# Altium schematic sheet RS485.SchDoc
size A4; SheetNumber: 6; SheetTotal: 7
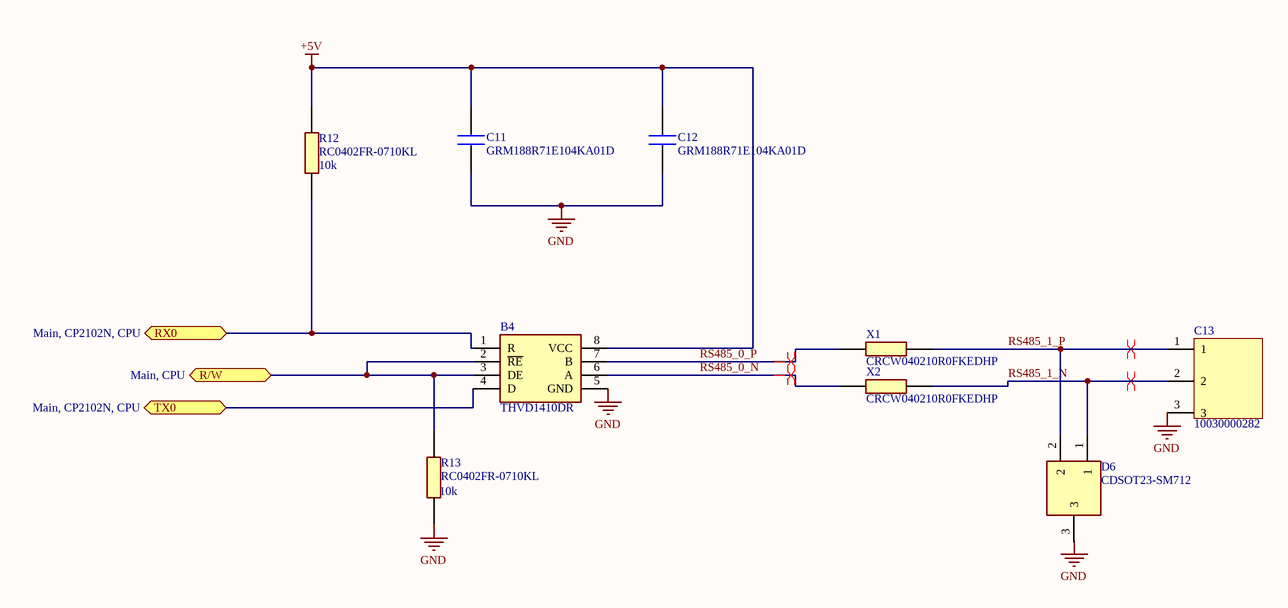
[diagram p0: RS485.SchDoc]

## Parts
B4  THVD1410DR  [SOIC127P600X175-8N]
C11  GRM188R71E104KA01D  [CAPC1608X90N]
C12  GRM188R71E104KA01D  [CAPC1608X90N]
C13  10030000282  [15EDGRC-5.08-03P-10030000282]
D6  CDSOT23-SM712  [SOT95P237X112-3N]
R12  RC0402FR-0710KL  value 10k  [RESC1005X40N]
R13  RC0402FR-0710KL  value 10k  [RESC1005X40N]
X1  CRCW040210R0FKEDHP  [RESC1005X40N]
X2  CRCW040210R0FKEDHP  [RESC1005X40N]

## Ports
R/W (bidir, see Main, CPU), RX0 (bidir, see Main, CP2102N, CPU), TX0 (bidir, see Main, CP2102N, CPU)

## Nets
+5V: B4.8(VCC) C11.2 C12.1 R12.2
GND: B4.5(GND) C11.1 C12.2 C13.3 R13.1
R/W: B4.2(~{RE}) B4.3(DE) R13.2 ; port R/W
RS485_0_N: B4.6(A) X2.1
RS485_0_P: B4.7(B) X1.1
RS485_1_N: C13.2 D6.1 X2.2
RS485_1_P: C13.1 D6.2 X1.2
RX0: B4.1(R) R12.1 ; port RX0
TX0: B4.4(D) ; port TX0

Not connected (* = marked no-connect by the designer): D6 3

## Layout directives
differential pair: RS485_0_N, RS485_0_P, RS485_1_N, RS485_1_P

## Notes on the sheet
- Labels drawn without touching a wire or pin: GND

## Library data of the parts
B4 = THVD1410DR: 3.3-V to 5-V RS-485 transceiver with +/-18-kV IEC ESD protection; Manufacturer_Name: Texas Instruments; Geometry.Height: 1.75mm; Mouser Part Number: 595-THVD1410DR; Mouser Price/Stock: https://www.mouser.co.uk/ProductDetail/Texas-Instruments/THVD1410DR?qs=chTDxNqvsylen%252BY7bN3dRQ%3D%3D; Manufacturer_Part_Number: THVD1410DR; Datasheet Link: http://www.ti.com/lit/gpn/THVD1410
C11 C12 = GRM188R71E104KA01D: Ceramic  SMT capacitor 100nF 25Vdc Murata 0603 GRM 1uF Ceramic Multilayer Capacitor, 25 V dc, +125degC, X7R Dielectric,  /-10%; Manufacturer_Name: Murata Electronics; Manufacturer_Part_Number: GRM188R71E105KA12D; Geometry.Height: 0.9mm; Mouser Part Number: 81-GRM188R71E105KA2D; Mouser Price/Stock: https://www.mouser.co.uk/ProductDetail/Murata-Electronics/GRM188R71E105KA12D?qs=62qOe8%2Fl8sHaxJyNXtrK%2FQ%3D%3D; Datasheet Link: https://datasheet.datasheetarchive.com/originals/distributors/Datasheets_SAMA/ec4f1577dddcc7a13ddad897a28002d3.pdf
C13 = 15EDGRC-5.08-03P: Pluggable Terminal Blocksnominal current7A.Rated voltage(Ⅱ/2)：450V,pitch:5.08mm,Color:green,Contact surface:Tin
D6 = CDSOT23-SM712: Diode; Manufacturer_Name: Bourns; Datasheet Link: http://uk.rs-online.com/web/p/products/7673728; Height: 1.17mm; Manufacturer_Part_Number: CDSOT23-SM712; Mouser Part Number: 652-CDSOT23-SM712; Mouser Price/Stock: https://www.mouser.co.uk/ProductDetail/Bourns/CDSOT23-SM712?qs=FuI%252BOVLl4%2FLTY%2FGQ265RLA%3D%3D; Arrow Part Number: CDSOT23-SM712; Arrow Price/Stock: https://www.arrow.com/en/products/cdsot23-sm712/bourns?region=europe
R12 R13 = RC0402FR-0710KL: Yageo 10k, 0402 (1005M) Thick Film SMD Resistor +/-1% 0.063W - RC0402FR-0710KL; Geometry.Height: 0.4mm; Mouser Part Number: 603-RC0402FR-0710KL; Mouser Price/Stock: https://www.mouser.co.uk/ProductDetail/YAGEO/RC0402FR-0710KL?qs=I1mnnYJTTsxUoNwrUsQExA%3D%3D; Manufacturer_Name: YAGEO; Manufacturer_Part_Number: RC0402FR-0710KL; Datasheet Link: https://componentsearchengine.com/Datasheets/2/RC0402FR-0710KL.pdf; Supplier Part Number 1: 7468275; Supplier 1: Future Electronics
X1 X2 = CRCW040210R0FKEDHP: Résistances à couches épaisses - CMS 0.2W 10ohms 1% High Power AEC-Q200; Manufacturer_Name: Vishay; Geometry.Height: 0.4mm; Mouser Part Number: 71-CRCW040210R0FKEDH; Mouser Price/Stock: https://www.mouser.co.uk/ProductDetail/Vishay-Dale/CRCW040227K4FKTD?qs=r5im4gEiTnFagxYI2ivMOg%3D%3D; Manufacturer_Part_Number: CRCW040210R0FKEDHP; Datasheet Link: http://www.vishay.com/docs/20035/dcrcwe3.pdf; Supplier 1: Mouser; Supplier Part Number 1: 71-CRCW040210R0FKEDH